# EasyEDA schematic Releais-Karte-A.00.01.json
TITLE: Sheet_1; REV: 1.0; Date: 2026-10-07; Sheet: 1/1; Drawn By: helmut-f; Company: Your Company
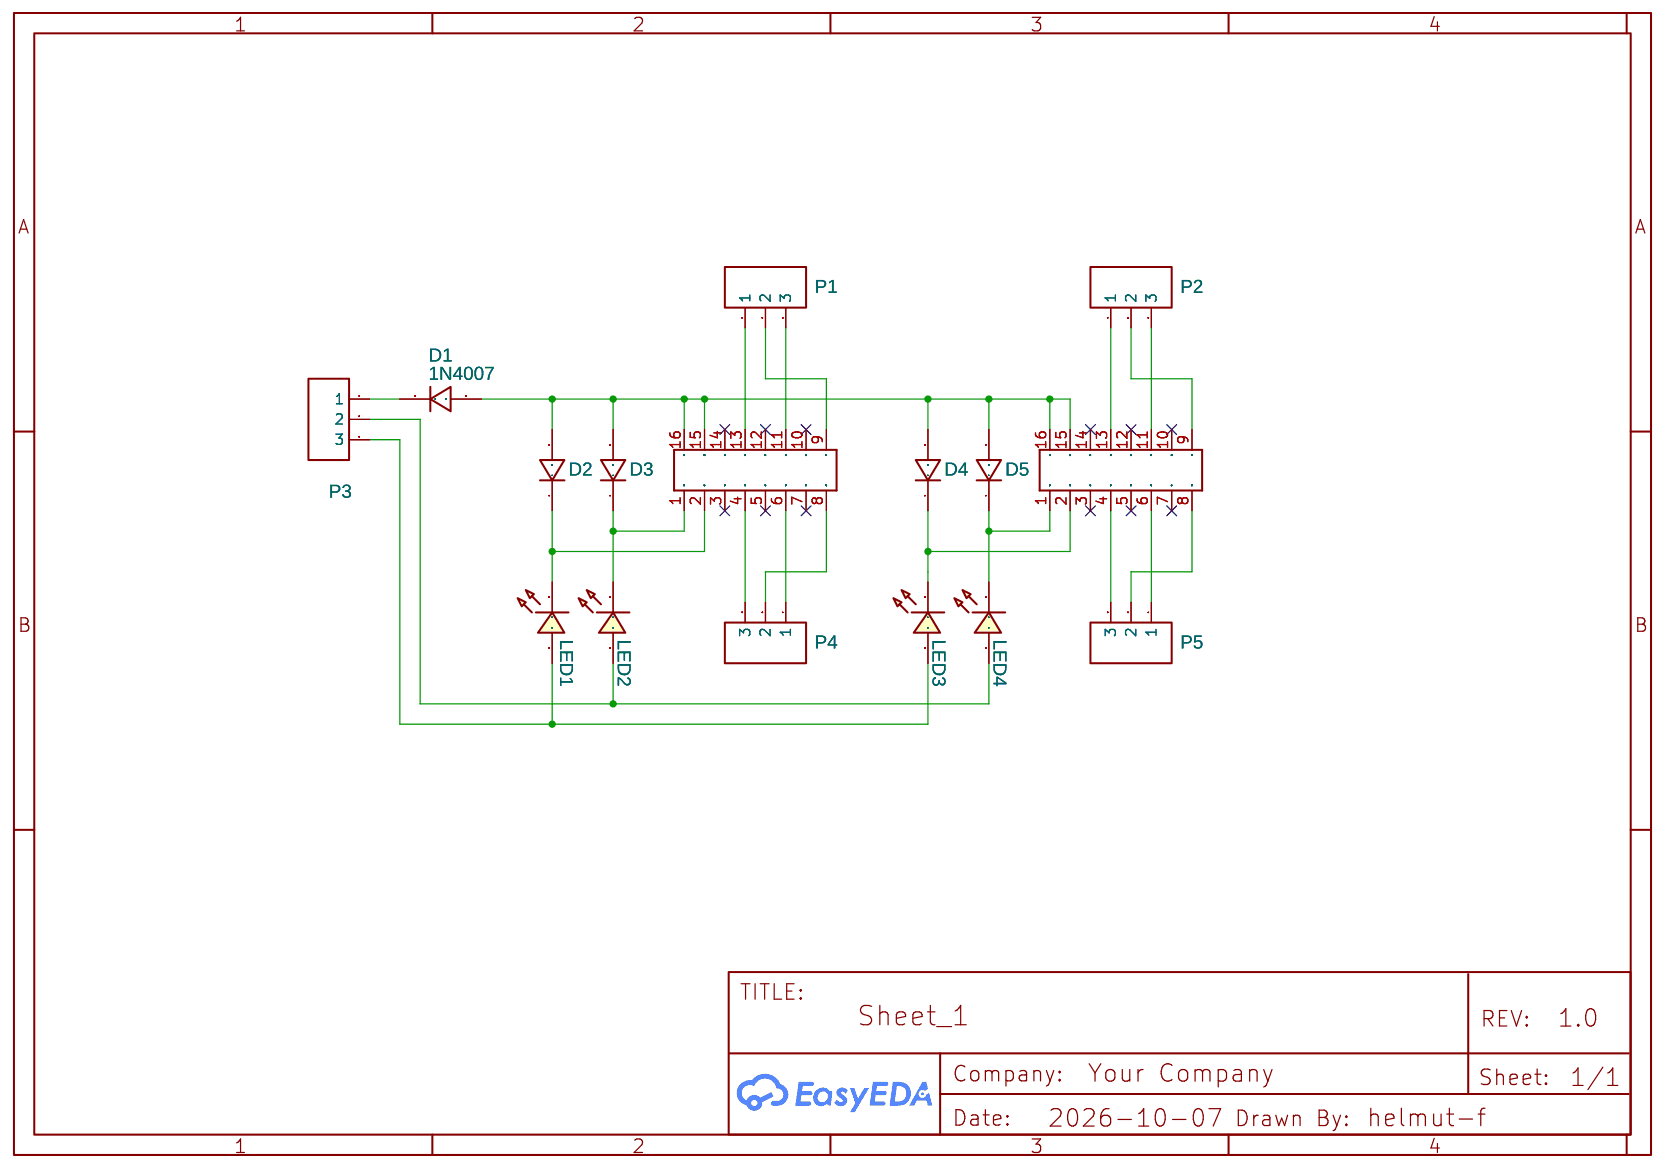
[diagram p0: schematic sheet]

## Parts
D1  1N4007  [DO-41_BD2.4-L4.7-P8.70-D0.9-RD]
D2  1N4007  [DO-41_BD2.4-L4.7-P8.70-D0.9-RD]
D3  1N4007  [DO-41_BD2.4-L4.7-P8.70-D0.9-RD]
D4  1N4007  [DO-41_BD2.4-L4.7-P8.70-D0.9-RD]
D5  1N4007  [DO-41_BD2.4-L4.7-P8.70-D0.9-RD]
J1  DIP-IC-SOCKET(2X8P-2.54) 16 pin  [SCK16-2.54-22.32X10.0MM]
J2  DIP-IC-SOCKET(2X8P-2.54) 16 pin  [SCK16-2.54-22.32X10.0MM]
LED1  LED-TH-3mm_R  [LED-TH_BD3.0_RED]
LED2  LED-TH-3mm_G  [LED-TH_BD3.0_GREEN]
LED3  LED-TH-3mm_R  [LED-TH_BD3.0_RED]
LED4  LED-TH-3mm_G  [LED-TH_BD3.0_GREEN]
P1  CONN-TH_3P-P5.08  [CONN-TH_3P-P5.08]
P2  CONN-TH_3P-P5.08  [CONN-TH_3P-P5.08]
P3  CONN-TH_3P-P5.08  [CONN-TH_3P-P5.08]
P4  CONN-TH_3P-P5.08  [CONN-TH_3P-P5.08]
P5  CONN-TH_3P-P5.08  [CONN-TH_3P-P5.08]

## Library data of the parts
D1-D5 = 1N4007: Supplier: LCSC; Manufacturer: SEMTECH; Supplier Part: C106903; Contributor: LCEDA_Lib
J1 J2 = DIP-IC-SOCKET(2X8P-2.54) 16 pin: 320070014; Contributor: jonathanl64
LED1 LED3 = LED-TH-3mm_R: Manufacturer: EVERLIGHT(台湾亿光); Manufacturer Part: 204-10SDRD/S530-A3-L; Supplier Part: C84774; Supplier: LCSC; Contributor: LCEDA_Lib
LED2 LED4 = LED-TH-3mm_G: Manufacturer: EVERLIGHT(台湾亿光); Manufacturer Part: 204-10SYGD/S530-E3; Supplier Part: C85161; Contributor: LCEDA_Lib
P1-P5 = CONN-TH_3P-P5.08: Supplier: LCSC; Contributor: LCEDA_Lib

## Nets
Net-(D1-1): D1.1 P3.1
Net-(D1-2): D1.2 D2.2 D3.2 D4.2 D5.2 J1.15(P$15) J1.16(P$16) J2.15(P$15) J2.16(P$16)
Net-(D2-1): D2.1 J1.2(P$2) LED1.2
Net-(D3-1): D3.1 J1.1(P$1) LED2.2
Net-(D4-1): D4.1 J2.2(P$2) LED3.2
Net-(D5-1): D5.1 J2.1(P$1) LED4.2
Net-(J1-4): J1.4(P$4) P4.3
Net-(J1-6): J1.6(P$6) P4.1
Net-(J1-8): J1.8(P$8) P4.2
Net-(J1-9): J1.9(P$9) P1.2
Net-(J1-11): J1.11(P$11) P1.3
Net-(J1-13): J1.13(P$13) P1.1
Net-(J2-4): J2.4(P$4) P5.3
Net-(J2-6): J2.6(P$6) P5.1
Net-(J2-8): J2.8(P$8) P5.2
Net-(J2-9): J2.9(P$9) P2.2
Net-(J2-11): J2.11(P$11) P2.3
Net-(J2-13): J2.13(P$13) P2.1
Net-(LED1-1): LED1.1 LED3.1 P3.3
Net-(LED2-1): LED2.1 LED4.1 P3.2

Not connected (* = marked no-connect by the designer): J1 3(P$3)* 5(P$5)* 7(P$7)* 10(P$10)* 12(P$12)* 14(P$14)*; J2 3(P$3)* 5(P$5)* 7(P$7)* 10(P$10)* 12(P$12)* 14(P$14)*
